# Altium project Bicycle Gauge.PrjPcb
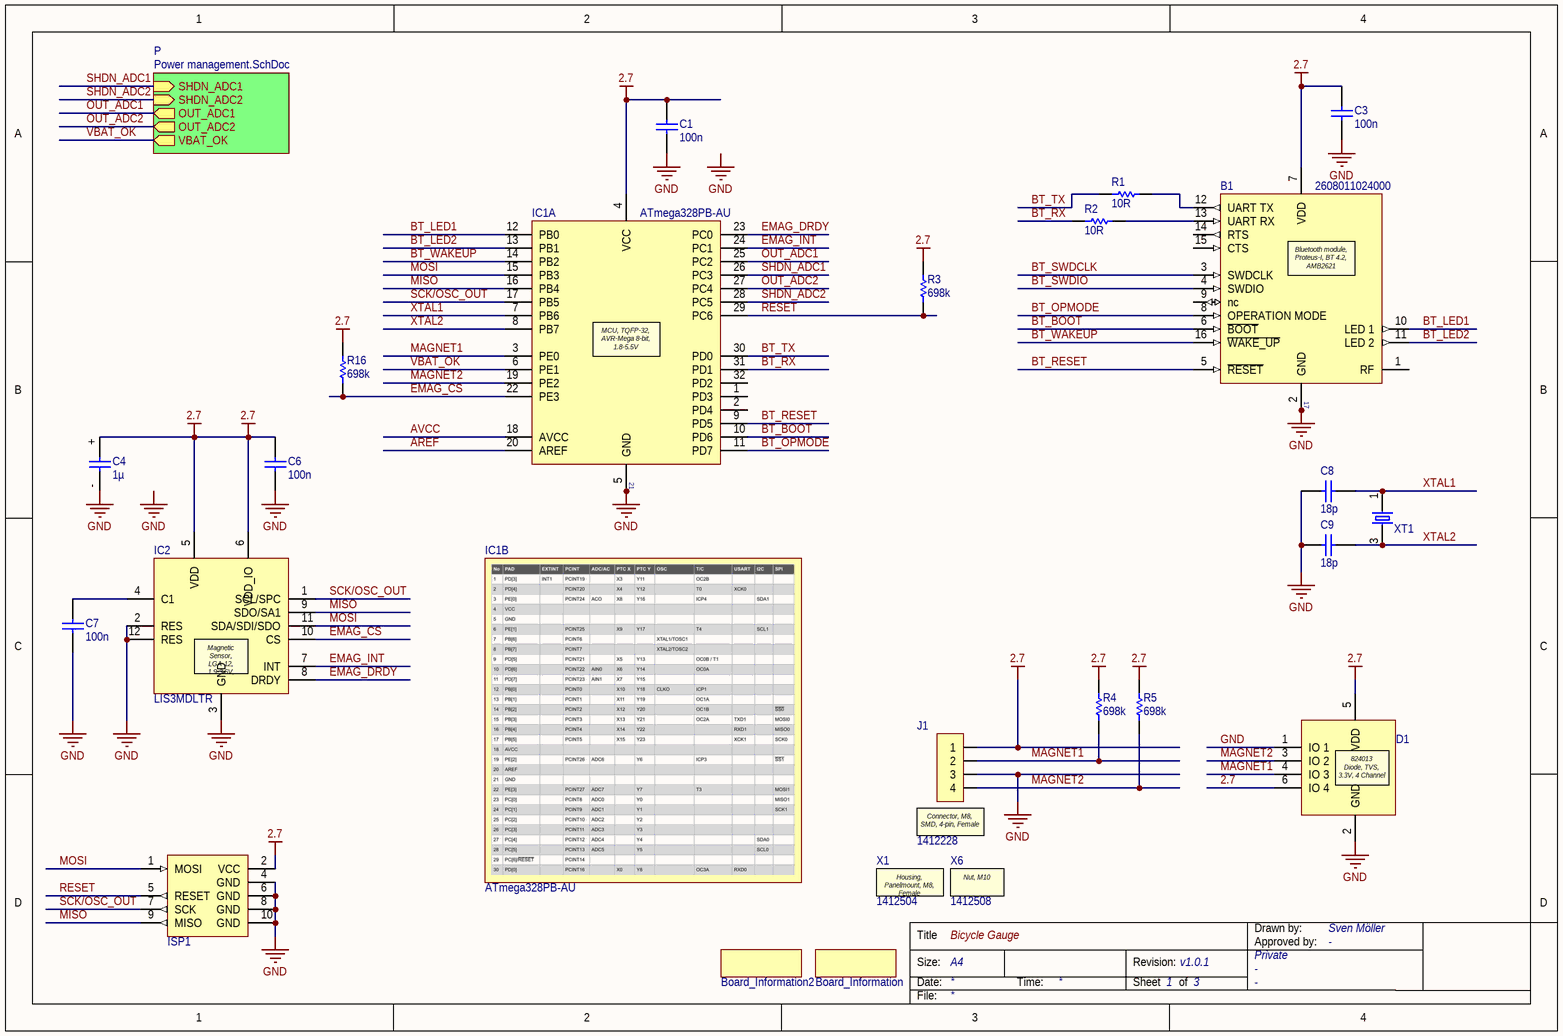
[diagram p0: Main.SchDoc]
Address1: -; Address2: -; Address3: -; Address4: -; ApprovedBy: -; DrawnBy: Sven Möller; Organization: Private; ProjectName: Bicycle Gauge; Revision: v1.0.1; ShortName: SM; Title: Bicycle Gauge
3 sheets, 59 parts. Net scope: hierarchical (ports join the sheet entries above them; power ports are global).
Sheets:
  Main.SchDoc
    P = Power management.SchDoc
      B1 = Battery Voltage Monitor.SchDoc
      B2 = Battery Voltage Monitor.SchDoc

## Sheet Main.SchDoc: Bicycle Gauge
size A4; ApprovedBy: -; DrawnBy: Sven Möller; Organization: Private; Address1: -; Address2: -; Address3: -; Address4: -; DocumentNumber: 1; Revision: v1.0.1; SheetNumber: 1; SheetTotal: 3; ProjectName: Bicycle Gauge

### Parts
B1  2608011024000  [AMB2621]
Board_Information  Board_Information  [Board_Information]  (value not drawn)  (no BOM)
Board_Information2  Board_Information  [Board_Information]  (value not drawn)  (no BOM)
C1  value 100n  [C0603]  (hidden comment: CC0603KRX7R9BB104)
C3  value 100n  [C0603]  (hidden comment: CC0603KRX7R9BB104)
C4  value 1µ  [ELCAP_4x5.4mm]  (hidden comment: EEE-FC1V1R0R)
C6  value 100n  [C0603]  (hidden comment: CC0603KRX7R9BB104)
C7  value 100n  [C0603]  (hidden comment: CC0603KRX7R9BB104)
C8  value 18p  [C0603]  (hidden comment: C0603C180J5GACTU)
C9  value 18p  [C0603]  (hidden comment: C0603C180J5GACTU)
D1  824013  [SOT-23-6]  (value not drawn)
IC1  ATmega328PB-AU  [TQFP-32]  (parts A,B of 2)
IC2  LIS3MDLTR  [LGA-12]
ISP1  TC2050-IDC-NL  [TC2050-IDC-NL]  (value not drawn)  (no BOM)
J1  1412228  [1412228]
R1  value 10R  [R0603]  (hidden comment: ERJ-3EKF10R0V)
R2  value 10R  [R0603]  (hidden comment: ERJ-3EKF10R0V)
R3  value 698k  [R0603]  (hidden comment: ERJ-3EKF6983V)
R4  value 698k  [R0603]  (hidden comment: ERJ-3EKF6983V)
R5  value 698k  [R0603]  (hidden comment: ERJ-3EKF6983V)
R16  value 698k  [R0603]  (hidden comment: ERJ-3EKF6983V)
X1  1412504  [1412504]
X6  1412508  [1412508]  (mechanical)
XT1  ABMM2-7.3728MHZ-E2-T  [Crystal_6x3.6mm]  (value not drawn)

### Sub-sheets
P = Power management.SchDoc: SHDN_ADC1 (in), SHDN_ADC2 (in), OUT_ADC1 (out), OUT_ADC2 (out), VBAT_OK (out)

### Nets
2.7: B1.7(VDD) C1.2 C3.2 C4.+ C6.2 D1.5(VDD) D1.6(IO_4) IC1.4(VCC) IC2.5(VDD) IC2.6(VDD_IO) ISP1.2(VCC) J1.1 R3.2 R4.2 R5.2 R16.2
GND: B1.2(GND) B1.17(GND) C1.1 C3.1 C4.- C6.1 C7.1 C8.1 C9.1 D1.1(IO_1) D1.2(GND) IC1.5(GND) IC1.21(GND) IC2.2(RES) IC2.3(GND) IC2.12(RES) ISP1.4(GND) ISP1.6(GND) ISP1.8(GND) ISP1.10(GND) J1.3
AREF: IC1.20(AREF)
AVCC: IC1.18(AVCC)
BT_BOOT: B1.6(~{BOOT}) IC1.10(PD6)
BT_LED1: B1.10(LED_1) IC1.12(PB0)
BT_LED2: B1.11(LED_2) IC1.13(PB1)
BT_OPMODE: B1.8(OPERATION_MODE) IC1.11(PD7)
BT_RESET: B1.5(~{RESET}) IC1.9(PD5)
BT_RX: IC1.31(PD1) R2.1
BT_SWDCLK: B1.3(SWDCLK)
BT_SWDIO: B1.4(SWDIO)
BT_TX: IC1.30(PD0) R1.1
BT_WAKEUP: B1.16(~{WAKE_UP}) IC1.14(PB2)
EMAG_CS: IC1.22(PE3) IC2.10(CS) R16.1
EMAG_DRDY: IC1.23(PC0) IC2.8(DRDY)
EMAG_INT: IC1.24(PC1) IC2.7(INT)
MAGNET1: D1.4(IO_3) IC1.3(PE0) J1.2 R4.1
MAGNET2: D1.3(IO_2) IC1.19(PE2) J1.4 R5.1
MISO: IC1.16(PB4) IC2.9(SDO/SA1) ISP1.9(MISO)
MOSI: IC1.15(PB3) IC2.11(SDA/SDI/SDO) ISP1.1(MOSI)
OUT_ADC1: IC1.25(PC2) ; sheet P/OUT_ADC1
OUT_ADC2: IC1.27(PC4) ; sheet P/OUT_ADC2
RESET: IC1.29(PC6) ISP1.5(RESET) R3.1
SCK/OSC_OUT: IC1.17(PB5) IC2.1(SCL/SPC) ISP1.7(SCK)
SHDN_ADC1: IC1.26(PC3) ; sheet P/SHDN_ADC1
SHDN_ADC2: IC1.28(PC5) ; sheet P/SHDN_ADC2
VBAT_OK: IC1.6(PE1) ; sheet P/VBAT_OK
XTAL1: C8.2 IC1.7(PB6) XT1.1
XTAL2: C9.2 IC1.8(PB7) XT1.3
NetB1_12: B1.12(UART_TX) R1.2
NetB1_13: B1.13(UART_RX) R2.2
NetC7_2: C7.2 IC2.4(C1)

Not connected (* = marked no-connect by the designer): B1 1(RF) 9(nc) 14(RTS) 15(CTS); IC1 1(PD3) 2(PD4) 32(PD2)

### Notes on the sheet
- Labels drawn without touching a wire or pin: GND
- Title
- Size:
- Date:
- A4
- Time:
- Revision:
- Sheet
- of
- Drawn by:
- Approved by:
- File:
- (in symbol 824013) 824013 / Diode, TVS, 3.3V, 4 Channel
- (in symbol 2608011024000) Bluetooth module, Proteus-I, BT 4.2, AMB2621 /

### Library data of the parts
B1 = 2608011024000: Bluetooth module, Proteus-I, BT 4.2, AMB2621; Manufacturer: Würth Elektronik; ComponentLink4URL: P:/ProteusI_2608011x2400x.pdf; ComponentLink4Description: Manual; OC_FEPA: *; ComponentLink3Description: Drawing; ComponentLink3URL: P:/2608011024000.pdf; Supplier 1: Digi-Key; Supplier Part Number 1: 1917-1014-1-ND; Supplier 2: Farnell; Supplier Part Number 2: 2917636; MPN: 2608011024000
Board_Information Board_Information2 = Board_Information: Board Information
C1 C3 C6 C7 = CC0603KRX7R9BB104: Cap, 100n, 0603, X7R, 50V; Manufacturer: Yageo; Rated Voltage: 50V; Dielectric: X7R; Temperature: 125°C; ComponentLink2URL: P:/UPY-GPHC_X7R_6.3V-to-50V_18.pdf; ComponentLink2Description: Part Series Datasheet; OC_FEPA: 1031198; Supplier 1: Digi-Key; Supplier Part Number 1: 311-1344-1-ND; Supplier Part Number 2: -; Supplier 2: Farnell; Supplier 3: Mouser; Supplier Part Number 3: 603-CC603KRX7R9BB104; MPN: CC0603KRX7R9BB104
C4 = EEE-FC1V1R0R: Cap, 1µ, 4x5.4mm, Aluminum Electrolyte, 35V; Manufacturer: Panasonic; Rated Voltage: 35V; Dielectric: Aluminum Electrolyte; Temperature: 105°C; ComponentLink2URL: P:/ABA0000C1172.pdf; ComponentLink2Description: Part Series Datasheet; OC_FEPA: *; MPN: EEE-FC1V1R0R; Supplier 1: Digi-Key; Supplier Part Number 1: PCE4024CT-ND; Supplier 2: Farnell; Supplier Part Number 2: 2357339; Supplier 3: Mouser; Supplier Part Number 3: 667-EEE-FC1V1R0R
C8 C9 = C0603C180J5GACTU: Cap, 18p, 0603, C0G, 50V; Manufacturer: Kemet; Rated Voltage: 50V; Dielectric: C0G; ComponentLink2URL: P:/KEM_C1003_C0G_SMD.pdf; ComponentLink2Description: Part Series Datasheet; OC_FEPA: *; MPN: C0603C180J5GACTU; Supplier 1: Digi-Key; Supplier Part Number 1: 399-1052-1-ND; Supplier 2: Farnell; Supplier Part Number 2: 1414620; Supplier 3: Mouser; Supplier Part Number 3: 80-C0603C180J5G
D1 = 824013: Diode, TVS, 3.3V, 4 Channel; Manufacturer: Würth Electronics; ComponentLink1URL: P:/824013.pdf; ComponentLink1Description: Datasheet; OC_FEPA: *; MPN: 824013; Supplier 1: Digi-Key; Supplier Part Number 1: 732-4466-1-ND; Supplier 2: Farnell; Supplier Part Number 2: 1825869; Supplier 3: Mouser; Supplier Part Number 3: 710-824013; Supplier 4: RSComponents; Supplier Part Number 4: 7546222
IC1 = ATmega328PB-AU: MCU, TQFP-32, AVR-Mega 8-bit, 1.8-5.5V; Manufacturer: Microchip; ComponentLink1URL: P:/40001906C.pdf; ComponentLink1Description: Datasheet; OC_FEPA: *; Supplier 1: Digi-Key; Supplier Part Number 1: ATMEGA328PB-AU-ND; Supplier 2: Farnell; Supplier Part Number 2: 2523203; Supplier 3: Mouser; Supplier Part Number 3: 556-ATMEGA328PB-AU; Supplier 4: RSComponents; Supplier Part Number 4: 1468928; MPN: ATmega328PB-AU
IC2 = LIS3MDLTR: Magnetic Sensor, LGA-12, 1.9-3.6V, +/-1.6mT; Manufacturer: ST Microelectronics; ComponentLink1URL: P:/en.DM00075867.pdf; ComponentLink1Description: Datasheet; OC_FEPA: *; Supplier 1: Digi-Key; Supplier Part Number 1: 497-13892-1-ND; Supplier 2: Farnell; Supplier Part Number 2: 2433083; Supplier 3: Mouser; Supplier Part Number 3: 511-LIS3MDLTR; Supplier 4: RSComponents; Supplier Part Number 4: 9172725; MPN: LIS3MDLTR
J1 = 1412228: Connector, M8, SMD, 4-pin, Female; Manufacturer: Phoenix Contact; ComponentLink1URL: P:/1412228.pdf; ComponentLink1Description: Datasheet; OC_FEPA: *; ComponentLink2Description: Part Series Datasheet; ComponentLink2URL: P:/52003587_EN_US_PLUSCON_circular_M5_M8_M12_LoRes.pdf; MPN: 1412228; Supplier 1: Digi-Key; Supplier Part Number 1: 1412228-ND; Supplier 2: Farnell; Supplier Part Number 2: -; Supplier 3: Mouser; Supplier Part Number 3: 651-1412228
R1 R2 = ERJ-3EKF10R0V: Res, 10R, 0603, 1%, 100mW, 50V; Manufacturer: Panasonic; Temperature Coefficient: 100ppm; Rated Voltage: 50V; Tolerance: 1%; Type: Thick Film; Rated Power: 100mW; OC_FEPA: *; ComponentLink2URL: P:/Panasonic-Precision_Thick_Film_Chip_Resistors-datasheet.pdf; ComponentLink2Description: Part Series Datasheet; Supplier 1: Digi-Key; Supplier Part Number 1: P10.0HCT-ND; Supplier 2: Farnell; Supplier Part Number 2: 2302958; Supplier 3: Mouser; Supplier Part Number 3: 667-ERJ-3EKF10R0V; MPN: ERJ-3EKF10R0V
R3-R5 R16 = ERJ-3EKF6983V: Res, 698k, 0603, 1%, 75V, 100mW; Manufacturer: Panasonic Electronic Components; Temperature Coefficient: 100ppm; Rated Voltage: 75V; Tolerance: 1%; Type: Thick Film; Rated Power: 100mW; OC_FEPA: *; ComponentLink2URL: P:/AOA0000C304.pdf; ComponentLink2Description: Part Series Datasheet; MPN: ERJ-3EKF6983V; Supplier 1: Digi-Key; Supplier Part Number 1: P698KHCT-ND; Supplier 2: Farnell; Supplier Part Number 2: 2303307; Supplier 3: Mouser; Supplier Part Number 3: 667-ERJ-3EKF6983V
X1 = 1412504: Housing, Panelmount, M8, Female; Manufacturer: Phoenix Contact; ComponentLink1URL: P:/1412504.pdf; ComponentLink1Description: Datasheet; OC_FEPA: 1030987; Supplier 1: Digi-Key; Supplier Part Number 1: 277-10310-ND; Supplier 2: Farnell; Supplier Part Number 2: -; Supplier 3: Mouser; Supplier Part Number 3: 651-1412504; MPN: 1412504
X6 = 1412508: Nut, M10; Manufacturer: Phoenix Contact; ComponentLink1URL: P:/1412508.pdf; ComponentLink1Description: Datasheet; OC_FEPA: 1030988; Supplier 1: Digi-Key; Supplier Part Number 1: 277-10312-ND; Supplier 2: Farnell; Supplier Part Number 2: -; Supplier 3: Mouser; Supplier Part Number 3: 651-1412508; MPN: 1412508
XT1 = ABMM2-7.3728MHZ-E2-T: Crystal, SMD, 7.3728MHz, 18pF; Manufacturer: Abracon; ComponentLink1URL: P:/Abracon-ABMM2-7.3728MHZ-E2-T-datasheet.pdf; ComponentLink1Description: Datasheet; OC_FEPA: *; MPN: ABMM2-7.3728MHZ-E2-T; Supplier 1: Digi-Key; Supplier Part Number 1: 535-10157-1-ND; Supplier 2: Farnell; Supplier Part Number 2: 2467857; Supplier 3: Mouser; Supplier Part Number 3: 815-ABMM2-7.3-E2-T; Supplier 4: RSComponents; Supplier Part Number 4: 1712788

## Sheet Power management.SchDoc: Power Managemant
size A4; ApprovedBy: -; DrawnBy: Sven Möller; Organization: Private; Address1: -; Address2: -; Address3: -; Address4: -; DocumentNumber: 2; Revision: v1.0.1; SheetNumber: 2; SheetTotal: 3; ProjectName: Bicycle Gauge
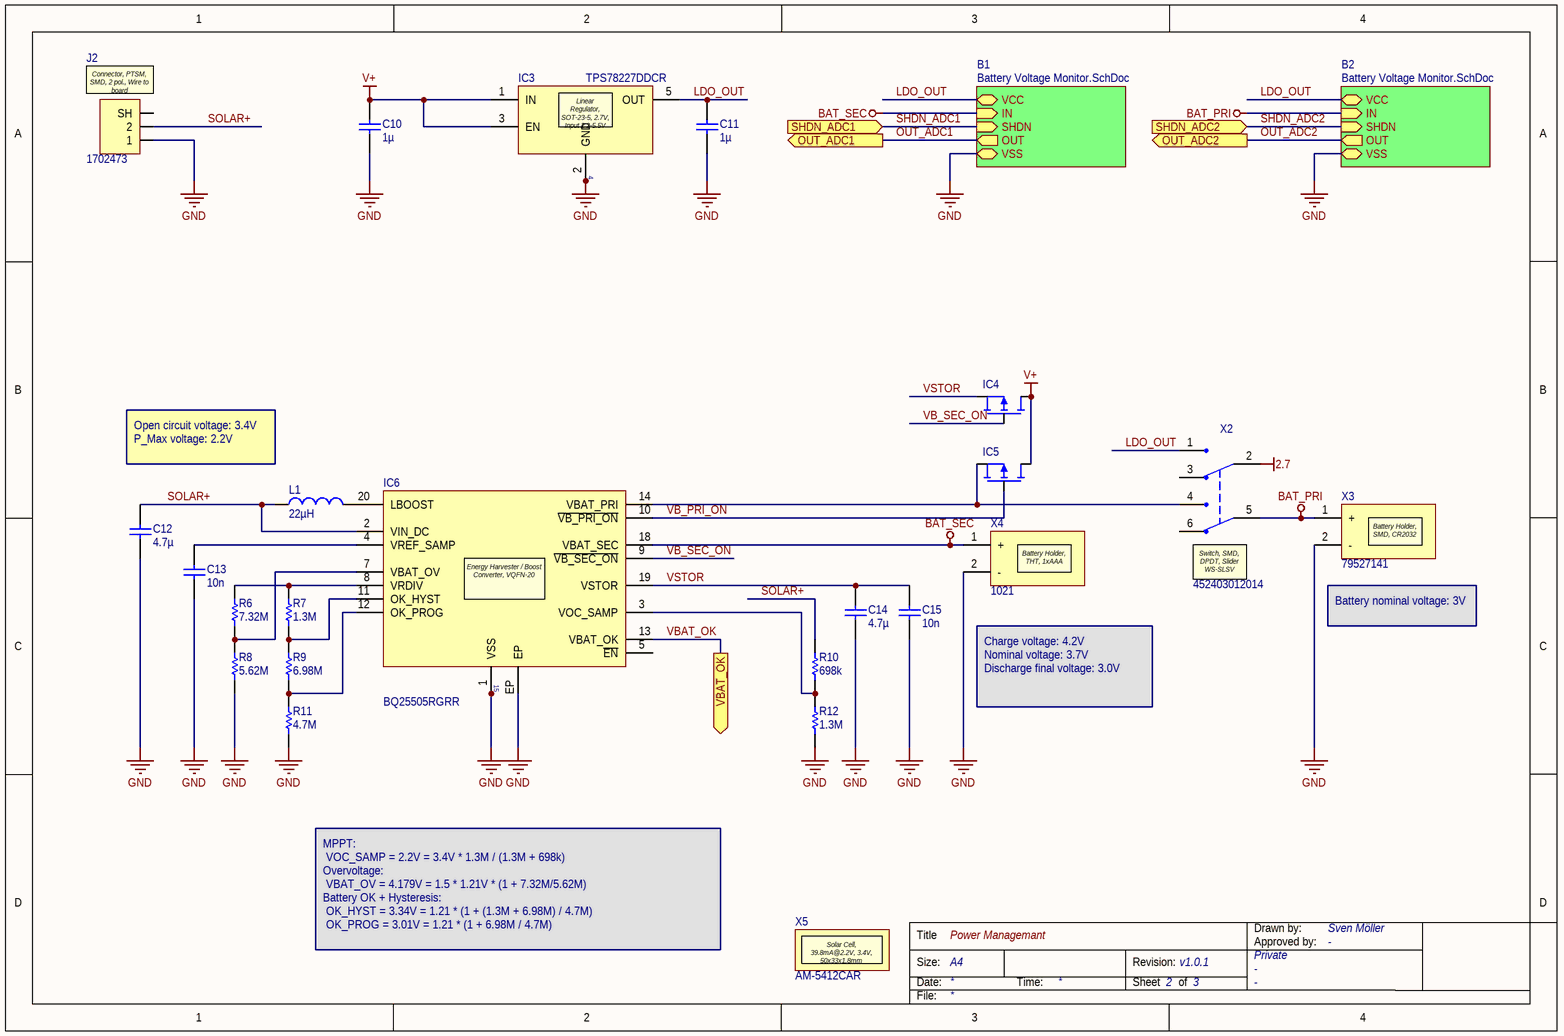
[diagram p1: Power management.SchDoc]

### Parts
C10  value 1µ  [C0805]  (hidden comment: GRM21BR71H105KA12L)
C11  value 1µ  [C0805]  (hidden comment: GRM21BR71H105KA12L)
C12  value 4.7µ  [C0603]  (hidden comment: C0603C475M8PACTU)
C13  value 10n  [C0603]  (hidden comment: C0603C103J3GACTU)
C14  value 4.7µ  [C0603]  (hidden comment: C0603C475M8PACTU)
C15  value 10n  [C0603]  (hidden comment: C0603C103J3GACTU)
IC3  TPS78227DDCR  [SOT-23-5]
IC4  PMZ950UPEL  [SOT-883]  (value not drawn)
IC5  PMZ950UPEL  [SOT-883]  (value not drawn)
IC6  BQ25505RGRR  [VQFN-20-EP_3.5x3.5]
J2  1702473  [1702473]
L1  value 22µH  [WE-TCP_3816]  (hidden comment: 744031220)
R6  value 7.32M  [R0603]  (hidden comment: CRCW06037M32FKEA)
R7  value 1.3M  [R0603]  (hidden comment: CRCW06031M30FKEA)
R8  value 5.62M  [R0603]  (hidden comment: CRCW06035M62FKEA)
R9  value 6.98M  [R0603]  (hidden comment: CRCW06036M98FKEA)
R10  value 698k  [R0603]  (hidden comment: ERJ-3EKF6983V)
R11  value 4.7M  [R0603]  (hidden comment: CRCW06034M70FKEA)
R12  value 1.3M  [R0603]  (hidden comment: CRCW06031M30FKEA)
X2  452403012014  [452403012014]
X3  79527141  [79527141]  (graphical)
X4  MPN: 1021  [Keystone_Electronics_1021]  (hidden comment: Keystone_Electronics_1021)
X5  AM-5412CAR  [AM-5412CAR]

### Sub-sheets
B1 = Battery Voltage Monitor.SchDoc: VCC, VSS, SHDN (in), OUT (out), IN (in)
B2 = Battery Voltage Monitor.SchDoc: VCC, VSS, SHDN (in), OUT (out), IN (in)

### Ports
OUT_ADC1 (out), OUT_ADC2 (out), SHDN_ADC1 (in), SHDN_ADC2 (in), VBAT_OK (out)

### Nets
2.7: X2.2(COM1)
BAT_PRI: X2.5(COM2) X3.1(+) ; sheet B2/IN
BAT_SEC: IC6.18(VBAT_SEC) X4.1(+) ; sheet B1/IN
GND: C10.1 C11.1 C12.1 C13.1 C14.1 C15.1 IC3.2(GND) IC3.4(GND) IC6.1(VSS) IC6.15(VSS) IC6.EP J2.1 R8.1 R11.1 R12.1 X3.2(-) X4.2(-) ; sheet B1/VSS, sheet B2/VSS
V+: C10.2 IC3.1(IN) IC3.3(EN) IC4.3(D) IC5.3(D)
LDO_OUT: C11.2 IC3.5(OUT) X2.1(NO1) ; sheet B1/VCC, sheet B2/VCC
OUT_ADC1: port OUT_ADC1, sheet B1/OUT
OUT_ADC2: port OUT_ADC2, sheet B2/OUT
SHDN_ADC1: port SHDN_ADC1, sheet B1/SHDN
SHDN_ADC2: port SHDN_ADC2, sheet B2/SHDN
SOLAR+: C12.2 IC6.2(VIN_DC) J2.2 L1.1 R10.2
VB_PRI_ON: IC5.1(G) IC6.10(~{VB_PRI_ON})
VB_SEC_ON: IC4.1(G) IC6.9(~{VB_SEC_ON})
VBAT_OK: IC6.13(VBAT_OK) ; port VBAT_OK
VSTOR: C14.2 C15.2 IC4.2(S) IC6.19(VSTOR)
NetC13_2: C13.2 IC6.4(VREF_SAMP)
NetIC5_2: IC5.2(S) IC6.14(VBAT_PRI) X2.4(NO2)
NetIC6_3: IC6.3(VOC_SAMP) R10.1 R12.2
NetIC6_7: IC6.7(VBAT_OV) R6.1 R8.2
NetIC6_8: IC6.8(VRDIV) R6.2 R7.2
NetIC6_11: IC6.11(OK_HYST) R7.1 R9.2
NetIC6_12: IC6.12(OK_PROG) R9.1 R11.2
NetIC6_20: IC6.20(LBOOST) L1.2
NetJ2_SH1: J2.SH1(SH) J2.SH2

Not connected (* = marked no-connect by the designer): IC6 5(~{EN}); X2 3(NC1) 6(NC2)

### Notes on the sheet
- Open circuit voltage: 3.4V
  P_Max voltage: 2.2V
- (near X3) Battery nominal voltage: 3V
- Charge voltage: 4.2V
  Nominal voltage: 3.7V
  Discharge final voltage: 3.0V
- MPPT:
  VOC_SAMP = 2.2V = 3.4V * 1.3M / (1.3M + 698k)
  Overvoltage:
  VBAT_OV = 4.179V = 1.5 * 1.21V * (1 + 7.32M/5.62M)
  Battery OK + Hysteresis:
  OK_HYST = 3.34V = 1.21 * (1 + (1.3M + 6.98M) / 4.7M)
  OK_PROG = 3.01V = 1.21 * (1 + 6.98M / 4.7M)
- Title
- Size:
- Date:
- A4
- Time:
- Revision:
- Sheet
- of
- Drawn by:
- Approved by:
- File:

### Library data of the parts
C10 C11 = GRM21BR71H105KA12L: Cap, 1µ, 0805, 50V, X7R; Manufacturer: Murata; Rated Voltage: 50V; Dielectric: X7R; Temperature: 125°C; ComponentLink2URL: p:\415379.pdf; ComponentLink1Description: Datasheet; ComponentLink2Description: Part Series Datasheet; ComponentLink1URL: p:\2047800.pdf; OC_FEPA: 1029873; Supplier 1: Digi-Key; Supplier Part Number 1: 490-4736-1-ND; Supplier 2: Farnell; Supplier Part Number 2: 1735541; Supplier 3: Mouser; Supplier Part Number 3: 81-GRM21BR71H105KA2L; MPN: GRM21BR71H105KA12L
C12 C14 = C0603C475M8PACTU: Cap, 4.7µ, 0603, X5R, 10V; Manufacturer: Kemet; Rated Voltage: 10V; Dielectric: X5R; ComponentLink2URL: P:/KEM_C1006_X5R_SMD.pdf; ComponentLink2Description: Part Series Datasheet; OC_FEPA: *; MPN: C0603C475M8PACTU; Supplier 1: Digi-Key; Supplier Part Number 1: 399-9100-1-ND; Supplier 2: Farnell; Supplier Part Number 2: 2112834; Supplier 3: Mouser; Supplier Part Number 3: 80-C0603C475M8P
C13 C15 = C0603C103J3GACTU: Cap, 10n, 0603, C0G, 25V; Manufacturer: Kemet; Rated Voltage: 25V; Dielectric: C0G; ComponentLink2URL: P:/KEM_C1003_C0G_SMD.pdf; ComponentLink2Description: Part Series Datasheet; OC_FEPA: *; MPN: C0603C103J3GACTU; Supplier 1: Digi-Key; Supplier Part Number 1: 399-7838-1-ND; Supplier 2: Farnell; Supplier Part Number 2: 1457729; Supplier 3: Mouser; Supplier Part Number 3: 80-C0603C103J3G
IC3 = TPS78227DDCR: Linear Regulator, SOT-23-5, 2.7V, Input 2.2-5.5V; Manufacturer: Texas Instruments; Additional Description: 130mV Dropout, Ultra low quiescent current; ComponentLink1URL: P:/tps782.pdf; ComponentLink1Description: Datasheet; OC_FEPA: *; Supplier 1: Digi-Key; Supplier Part Number 1: 296-23825-1-ND; Supplier 2: Farnell; Supplier Part Number 2: 2352270; Supplier 3: Mouser; Supplier Part Number 3: 595-TPS78227DDCR; Supplier 4: RSComponents; Supplier Part Number 4: 8175436; MPN: TPS78227DDCR
IC4 IC5 = PMZ950UPEL: MOSFET, SOT-883, p-channel, -20V, -0.5A, low leakage current; Manufacturer: Nexperia; ComponentLink1URL: P:/PMZ950UPEL.pdf; ComponentLink1Description: Datasheet; OC_FEPA: *; Supplier 1: Digi-Key; Supplier Part Number 1: 1727-2599-1-ND; Supplier 2: Farnell; Supplier Part Number 2: 2673080; Supplier 3: Mouser; Supplier Part Number 3: 771-PMZ950UPELYL; MPN: PMZ950UPEL
IC6 = BQ25505RGRR: Energy Harvester / Boost Converter, VQFN-20; Manufacturer: Texas Instruments; ComponentLink1URL: P:/bq25505.pdf; ComponentLink1Description: Datasheet; OC_FEPA: *; MPN: BQ25505RGRR; Supplier 1: Digi-Key; Supplier Part Number 1: 296-37078-1-ND; Supplier 2: Farnell; Supplier Part Number 2: -; Supplier 3: Mouser; Supplier Part Number 3: 595-BQ25505RGRR
J2 = 1702473: Connector, PTSM, SMD, 2 pol., Wire to board; Manufacturer: Phoenix Contact; ComponentLink1URL: P:/1702473.pdf; ComponentLink1Description: Datasheet; OC_FEPA: *; ComponentLink3Description: Drawing; ComponentLink3URL: P:/pxc_1702473_01_PTSM-0-5-2-2-5-H-SMD-R24_FAM.pdf; Supplier 1: Digi-Key; Supplier Part Number 1: 277-2337-1-ND; Supplier 2: Farnell; Supplier Part Number 2: 1793797; Supplier 3: Mouser; Supplier Part Number 3: 651-1702473; MPN: 1702473
L1 = 744031220: Ind, 22µH, 0.51A, 3.8x3.8x1.65mm; Manufacturer: Würth Elektronik; OC_FEPA: *; ComponentLink3Description: Drawing; ComponentLink3URL: P:/744031220.pdf; MPN: 744031220; Supplier 1: Digi-Key; Supplier Part Number 1: 732-1012-1-ND; Supplier 2: Farnell; Supplier Part Number 2: 1890602; Supplier 3: Mouser; Supplier Part Number 3: 710-744031220; Supplier 4: RSComponents; Supplier Part Number 4: 617-0903
R6 = CRCW06037M32FKEA: Res, 7.32M, 0603, 1%, 75V, 100mW; Manufacturer: Vishay Dale; Temperature Coefficient: 100ppm; Rated Voltage: 75V; Tolerance: 1%; Type: Thick Film; Rated Power: 100mW; OC_FEPA: *; ComponentLink2URL: P:/dcrcwe3.pdf; ComponentLink2Description: Part Series Datasheet; MPN: CRCW06037M32FKEA; Supplier 1: Digi-Key; Supplier Part Number 1: 541-7.32MHCT-ND; Supplier 2: Farnell; Supplier Part Number 2: 2138713; Supplier 3: Mouser; Supplier Part Number 3: 71-CRCW06037M32FKEA
R7 R12 = CRCW06031M30FKEA: Res, 1.3M, 0603, 1%, 75V, 100mW; Manufacturer: Vishay Dale; Temperature Coefficient: 100ppm; Rated Voltage: 75V; Tolerance: 1%; Type: Thick Film; Rated Power: 100mW; OC_FEPA: *; ComponentLink2URL: P:/dcrcwe3.pdf; ComponentLink2Description: Part Series Datasheet; MPN: CRCW06031M30FKEA; Supplier 1: Digi-Key; Supplier Part Number 1: 541-1.30MHCT-ND; Supplier 2: Farnell; Supplier Part Number 2: 2138620; Supplier 3: Mouser; Supplier Part Number 3: 71-CRCW06031M30FKEA
R8 = CRCW06035M62FKEA: Res, 5.62M, 0603, 1%, 75V, 100mW; Manufacturer: Vishay Dale; Temperature Coefficient: 100ppm; Rated Voltage: 75V; Tolerance: 1%; Type: Thick Film; Rated Power: 100mW; OC_FEPA: *; ComponentLink2URL: P:/dcrcwe3.pdf; ComponentLink2Description: Part Series Datasheet; MPN: CRCW06035M62FKEA; Supplier 1: Digi-Key; Supplier Part Number 1: 541-5.62MHCT-ND; Supplier 2: Farnell; Supplier Part Number 2: 2138698; Supplier 3: Mouser; Supplier Part Number 3: 71-CRCW06035M62FKEA
R9 = CRCW06036M98FKEA: Res, 6.98M, 0603, 1%, 75V, 100mW; Manufacturer: Vishay Dale; Temperature Coefficient: 100ppm; Rated Voltage: 75V; Tolerance: 1%; Type: Thick Film; Rated Power: 100mW; OC_FEPA: *; ComponentLink2URL: P:/dcrcwe3.pdf; ComponentLink2Description: Part Series Datasheet; MPN: CRCW06036M98FKEA; Supplier 1: Digi-Key; Supplier Part Number 1: 541-6.98MHCT-ND; Supplier 2: Farnell; Supplier Part Number 2: 2138710; Supplier 3: Mouser; Supplier Part Number 3: 71-CRCW06036M98FKEA
R10 = ERJ-3EKF6983V: as R3 on sheet Main; Rated Voltage: 75V; Tolerance: 1%; Type: Thick Film; Rated Power: 100mW; OC_FEPA: *; ComponentLink2URL: P:/AOA0000C304.pdf; ComponentLink2Description: Part Series Datasheet; MPN: ERJ-3EKF6983V; Supplier 1: Digi-Key; Supplier Part Number 1: P698KHCT-ND; Supplier 2: Farnell; Supplier Part Number 2: 2303307; Supplier 3: Mouser; Supplier Part Number 3: 667-ERJ-3EKF6983V
R11 = CRCW06034M70FKEA: Res, 4.7M, 0603, 1%, 75V, 100mW; Manufacturer: Vishay Dale; Temperature Coefficient: 100ppm; Rated Voltage: 75V; Tolerance: 1%; Type: Thick Film; Rated Power: 100mW; OC_FEPA: *; ComponentLink2URL: P:/dcrcwe3.pdf; ComponentLink2Description: Part Series Datasheet; MPN: CRCW06034M70FKEA; Supplier 1: Digi-Key; Supplier Part Number 1: 541-4.70MHCT-ND; Supplier 2: Farnell; Supplier Part Number 2: 2138688; Supplier 3: Mouser; Supplier Part Number 3: 71-CRCW0603-4.7M-E3
X2 = 452403012014: Switch, SMD, DPDT, Slider WS-SLSV; Manufacturer: Würth Elektronik; OC_FEPA: *; ComponentLink3Description: Drawing; ComponentLink3URL: P:/452403012014.pdf; Supplier 1: Digi-Key; Supplier Part Number 1: 732-10145-1-ND; Supplier 2: Farnell; Supplier Part Number 2: -; Supplier 3: Mouser; Supplier Part Number 3: 710-452403012014; MPN: 452403012014
X3 = 79527141: Battery Holder, SMD, CR2032; Manufacturer: Würth Elektronik; OC_FEPA: *; ComponentLink3Description: Drawing; ComponentLink3URL: P:/79527141.pdf; Supplier 1: Digi-Key; Supplier Part Number 1: 732-12325-1-ND; Supplier 2: Farnell; Supplier Part Number 2: -; Supplier 3: Mouser; Supplier Part Number 3: 710-79527141; Supplier 4: RSComponents; Supplier Part Number 4: 1842347; MPN: 79527141
X4 = Keystone_Electronics_1021: Battery Holder, THT, 1xAAA; Manufacturer: Keystone Electronics; OC_FEPA: *; ComponentLink2Description: Part Series Datasheet; ComponentLink2URL: P:/M65p22.pdf; ComponentLink3Description: Drawing; ComponentLink3URL: P:/1021.PDF; Supplier 1: Digi-Key; Supplier Part Number 1: 36-1021-ND; Supplier 2: Farnell; Supplier Part Number 2: -; Supplier 3: Mouser; Supplier Part Number 3: 534-1021; Supplier 4: Conrad; Supplier Part Number 4: 1555480
X5 = AM-5412CAR: Solar Cell, 39.8mA@2.2V, 3.4V, 50x33x1.8mm; Manufacturer: Panasonic BSG; OC_FEPA: *; ComponentLink2Description: Part Series Datasheet; ComponentLink2URL: P:/Amorphous_Br.pdf; Supplier 1: Digi-Key; Supplier Part Number 1: 869-1007-ND; Supplier 2: Farnell; Supplier Part Number 2: -; Supplier 3: Mouser; Supplier Part Number 3: 658-AM-5412CAR; MPN: AM-5412CAR

## Sheet Battery Voltage Monitor.SchDoc: Battery Monitor
size A4; ApprovedBy: -; DrawnBy: Sven Möller; Organization: Private; Address1: -; Address2: -; Address3: -; Address4: -; DocumentNumber: 3; Revision: v1.0.1; SheetNumber: 3; SheetTotal: 3; ProjectName: Bicycle Gauge
Used 2 times, as channels P/B1, P/B2. Parts and nets are listed once, with the designators drawn on the sheet.
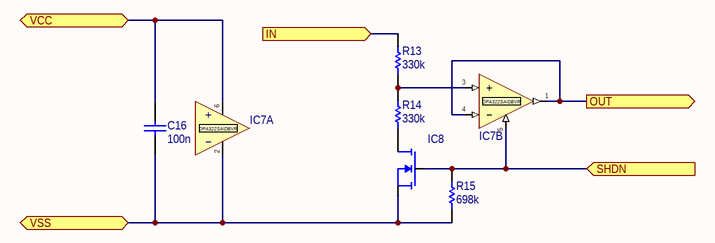
[diagram p2: Battery Voltage Monitor.SchDoc]

### Parts
C16  value 100n  [C0603]  (hidden comment: CC0603KRX7R9BB104)
IC7  OPA322SAIDBVR  [SOT-23-6]  (value not drawn)  (parts A,B of 2)
IC8  PMZ600UNEL  [SOT-883]  (value not drawn)
R13  value 330k  [R0603]  (hidden comment: ERA-3AEB334V)
R14  value 330k  [R0603]  (hidden comment: ERA-3AEB334V)
R15  value 698k  [R0603]  (hidden comment: ERJ-3EKF6983V)

### Ports
IN (in), OUT (out), SHDN (in), VCC, VSS

### Nets
IN: R13.2 ; port IN
OUT: IC7.1(Out) IC7.4(−) ; port OUT
SHDN: IC7.5(~{SHDN}) IC8.1(G) R15.2 ; port SHDN
VCC: C16.2 IC7.6(+) ; port VCC
VSS: C16.1 IC7.2(-) IC8.2(S) R15.1 ; port VSS
NetIC7_3: IC7.3(+) R13.1 R14.2
NetIC8_3: IC8.3(D) R14.1

### Channels
P/B1: designators end in A; ports IN=BAT_SEC OUT=OUT_ADC1 SHDN=SHDN_ADC1 VCC=LDO_OUT VSS=GND
P/B2: designators end in B; ports IN=BAT_PRI OUT=OUT_ADC2 SHDN=SHDN_ADC2 VCC=LDO_OUT VSS=GND

### Notes on the sheet
- Title
- Size:
- Date:
- A4
- Time:
- Revision:
- Sheet
- of
- Drawn by:
- Approved by:
- File:

### Library data of the parts
C16 = CC0603KRX7R9BB104: as C1 on sheet Main; Rated Voltage: 50V; Dielectric: X7R; Temperature: 125°C; ComponentLink2URL: P:/UPY-GPHC_X7R_6.3V-to-50V_18.pdf; ComponentLink2Description: Part Series Datasheet; OC_FEPA: 1031198; Supplier 1: Digi-Key; Supplier Part Number 1: 311-1344-1-ND; Supplier Part Number 2: -; Supplier 2: Farnell; Supplier 3: Mouser; Supplier Part Number 3: 603-CC603KRX7R9BB104; MPN: CC0603KRX7R9BB104
IC7 = OPA322SAIDBVR: Op-Amp, SOT-32, 1.7-5.5V, Rail-to-rail, Nanopower; Manufacturer: Texas Instruments; ComponentLink1URL: P:/opa322.pdf; ComponentLink1Description: Datasheet; OC_FEPA: *; MPN: OPA322SAIDBVR; Supplier Part Number 2: -; Supplier 2: Farnell; Supplier 1: Digi-Key; Supplier Part Number 1: 296-40465-1-ND; Supplier 3: Mouser; Supplier Part Number 3: 595-OPA322SAIDBVR
IC8 = PMZ600UNEL: MOSFET, SOT-883, n-channel, 20V, 0.6A, low leakage current; Manufacturer: Nexperia; ComponentLink1URL: P:/PMZ600UNEL.pdf; ComponentLink1Description: Datasheet; OC_FEPA: *; Supplier 1: Digi-Key; Supplier Part Number 1: 1727-2598-1-ND; Supplier 2: Farnell; Supplier Part Number 2: 2673079; Supplier 3: Mouser; Supplier Part Number 3: 771-PMZ600UNELYL; MPN: PMZ600UNEL
R13 R14 = ERA-3AEB334V: Res, 330k, 0603, 0.1%, 25ppm, 75V, 100mW; Manufacturer: Panasonic Electronic Components; Rated Voltage: 75V; Tolerance: 0.1%; Type: Thin Film; Rated Power: 100mW; OC_FEPA: *; ComponentLink2URL: P:/AOA0000C307.pdf; ComponentLink2Description: Part Series Datasheet; Temperature Coefficient: 25ppm; MPN: ERA-3AEB334V; Supplier 1: Digi-Key; Supplier Part Number 1: P330KDBCT-ND; Supplier 2: Farnell; Supplier Part Number 2: 1577639; Supplier 3: Mouser; Supplier Part Number 3: 667-ERA-3AEB334V
R15 = ERJ-3EKF6983V: as R3 on sheet Main; Rated Voltage: 75V; Tolerance: 1%; Type: Thick Film; Rated Power: 100mW; OC_FEPA: *; ComponentLink2URL: P:/AOA0000C304.pdf; ComponentLink2Description: Part Series Datasheet; MPN: ERJ-3EKF6983V; Supplier 1: Digi-Key; Supplier Part Number 1: P698KHCT-ND; Supplier 2: Farnell; Supplier Part Number 2: 2303307; Supplier 3: Mouser; Supplier Part Number 3: 667-ERJ-3EKF6983V

## Nets that join several sheets
2.7: Main (16 pins), Power management (X2.2)
BAT_PRI: Power management (X2.5 X3.1), P/B2 (R13B.2)
BAT_SEC: Power management (IC6.18 X4.1), P/B1 (R13A.2)
GND: Main (21 pins), Power management (17 pins), P/B1 (C16A.1 IC7A.2 IC8A.2 R15A.1), P/B2 (C16B.1 IC7B.2 IC8B.2 R15B.1)
LDO_OUT: Power management (C11.2 IC3.5 X2.1), P/B1 (C16A.2 IC7A.6), P/B2 (C16B.2 IC7B.6)
OUT_ADC1: Main (IC1.25), P/B1 (IC7A.1 IC7A.4)
OUT_ADC2: Main (IC1.27), P/B2 (IC7B.1 IC7B.4)
SHDN_ADC1: Main (IC1.26), P/B1 (IC7A.5 IC8A.1 R15A.2)
SHDN_ADC2: Main (IC1.28), P/B2 (IC7B.5 IC8B.1 R15B.2)
VBAT_OK: Main (IC1.6), Power management (IC6.13)

## Assembly variants
Variant of Bicycle Gauge: not fitted X3